# EAGLE design Steuerungsmodul (EAGLE 9.6.2)
BRD_SHEET_NAME: Schaltplan; PROJEKT_NAME: Verstärker_Innovativwoche; REVISION: 1.0; SCH_SHEET_NAME: Steuerungsmodul Verstärker; USER_NAME: Melcher-Millner/Scheffknecht

## Sheet 1 of 2: Input Switch
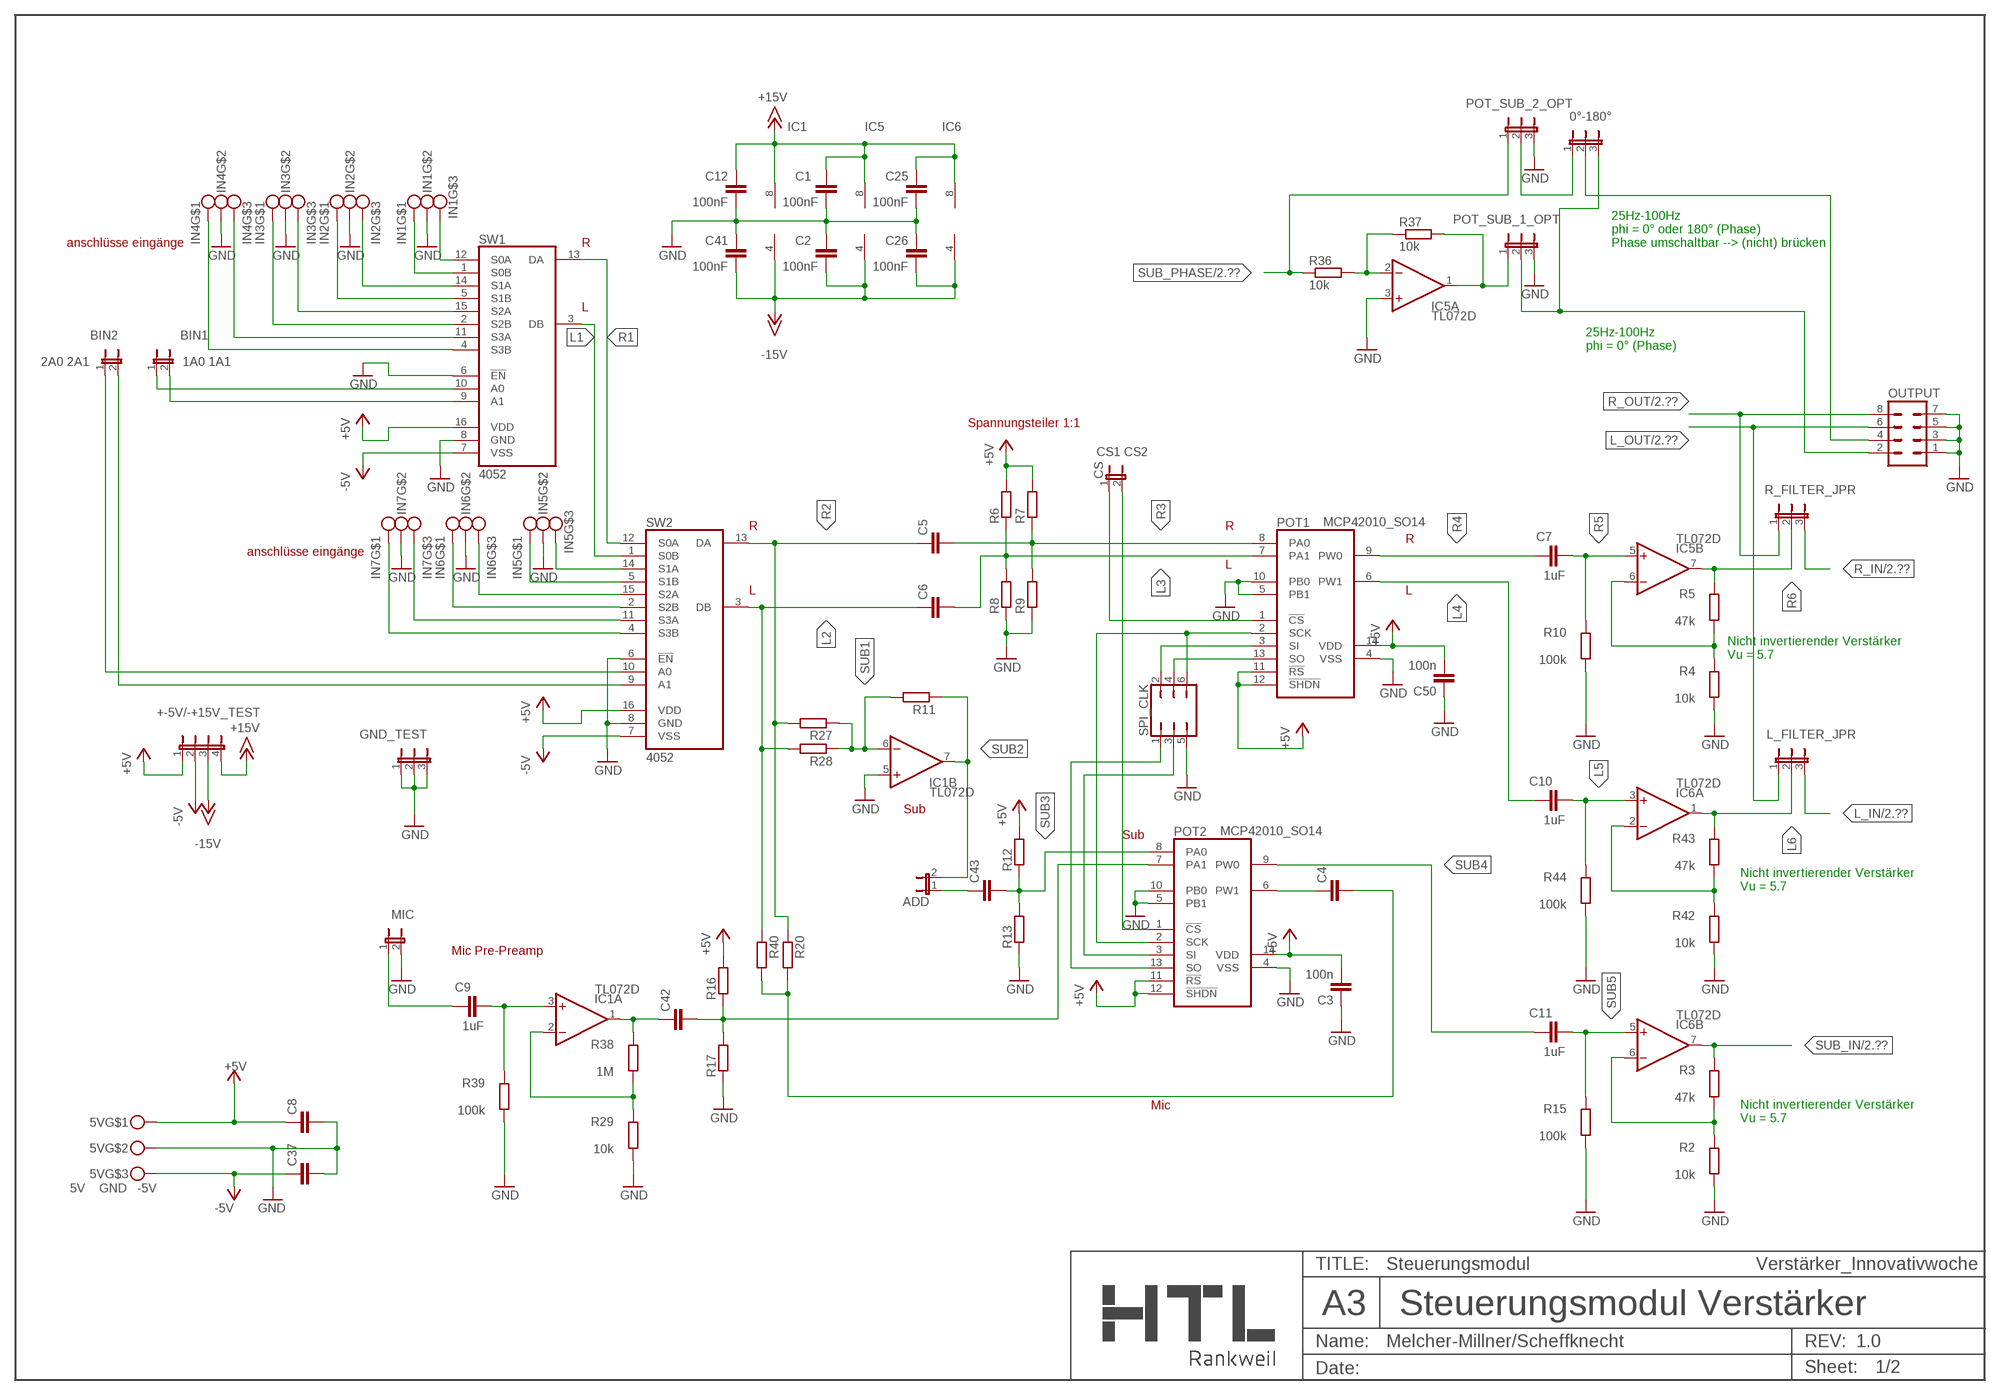
[diagram p0: schematic, sheet 1]

### Parts
0°-180°  JMP3  [JMP3]
5V  5V GND -5V  MKDS3/3_5,08  [MKDS3/3_5,08]
+-5V/-+15V_TEST  JP4E  [JP4]
ADD  JMP2  [JMP2]
BIN1  1A0 1A1  JMP2  [JMP2]
BIN2  2A0 2A1  JMP2  [JMP2]
C1  100nF  C-EUC0805  [C0805]
C2  100nF  C-EUC0805  [C0805]
C3  100n  C-EUC0805  [C0805]
C4  C-EUC0805  [C0805]
C5  C-EUC0805  [C0805]
C6  C-EUC0805  [C0805]
C7  1uF  C-EU025-025X050  [C025-025X050]
C8  C-EUC0805  [C0805]
C9  1uF  C-EU025-025X050  [C025-025X050]
C10  1uF  C-EU025-025X050  [C025-025X050]
C11  1uF  C-EU025-025X050  [C025-025X050]
C12  100nF  C-EUC0805  [C0805]
C25  100nF  C-EUC0805  [C0805]
C26  100nF  C-EUC0805  [C0805]
C37  C-EUC0805  [C0805]
C41  100nF  C-EUC0805  [C0805]
C42  C-EUC0805  [C0805]
C43  C-EUC0805  [C0805]
C50  100n  C-EUC0805  [C0805]
CS  CS1 CS2  JMP2  [JMP2]
FRAME1  HTL-A3-H  [HTL-LEER]
GND_TEST  JMP3  [JMP3]
IC1  TL072D  [SO08]
IC5  TL072D  [SO08]
IC6  TL072D  [SO08]
IN1  MKDS3/3_5,08  [MKDS3/3_5,08]
IN2  MKDS3/3_5,08  [MKDS3/3_5,08]
IN3  MKDS3/3_5,08  [MKDS3/3_5,08]
IN4  MKDS3/3_5,08  [MKDS3/3_5,08]
IN5  MKDS3/3_5,08  [MKDS3/3_5,08]
IN6  MKDS3/3_5,08  [MKDS3/3_5,08]
IN7  MKDS3/3_5,08  [MKDS3/3_5,08]
L_FILTER_JPR  JMP3  [JMP3]
MIC  JMP2  [JMP2]
OUTPUT  MA04-2  [MA04-2]
POT1  MCP42010_SO14  [SO14]
POT2  MCP42010_SO14  [SO14]
POT_SUB_1_OPT  JMP3  [JMP3]
POT_SUB_2_OPT  JMP3  [JMP3]
R2  10k  R-EU_M0805  [M0805]
R3  47k  R-EU_M0805  [M0805]
R4  10k  R-EU_M0805  [M0805]
R5  47k  R-EU_M0805  [M0805]
R6  R-EU_M0805  [M0805]
R7  R-EU_M0805  [M0805]
R8  R-EU_M0805  [M0805]
R9  R-EU_M0805  [M0805]
R10  100k  R-EU_M0805  [M0805]
R11  R-EU_M0805  [M0805]
R12  R-EU_M0805  [M0805]
R13  R-EU_M0805  [M0805]
R15  100k  R-EU_M0805  [M0805]
R16  R-EU_M0805  [M0805]
R17  R-EU_M0805  [M0805]
R20  R-EU_M0805  [M0805]
R27  R-EU_M0805  [M0805]
R28  R-EU_M0805  [M0805]
R29  10k  R-EU_M0805  [M0805]
R36  10k  R-EU_M0805  [M0805]
R37  10k  R-EU_M0805  [M0805]
R38  1M  R-EU_M0805  [M0805]
R39  100k  R-EU_M0805  [M0805]
R40  R-EU_M0805  [M0805]
R42  10k  R-EU_M0805  [M0805]
R43  47k  R-EU_M0805  [M0805]
R44  100k  R-EU_M0805  [M0805]
R_FILTER_JPR  JMP3  [JMP3]
SPI_CLK  JP3Q  [JP3Q]
SW1  4052  5042_SO16_NEU  [SO-16]
SW2  4052  5042_SO16_NEU  [SO-16]

### Nets
1A0: BIN1.1 SW1.10(A0)
1A1: BIN1.2 SW1.9(A1)
2A0: BIN2.1 SW2.10(A0)
2A1: BIN2.2 SW2.9(A1)
+5V: 5V.P$1 +-5V/-+15V_TEST.1 C3.2 C8.1 C50.2 POT1.11(!RS) POT1.12(!SHDN) POT1.14(VDD) POT2.11(!RS) POT2.12(!SHDN) POT2.14(VDD) R6.2 R7.2 R12.2 R16.2 SW1.16(VDD) SW2.16(VDD)
+15V: +-5V/-+15V_TEST.4 C1.1 C12.1 C25.1 IC1.8(P:V+) IC5.8(P:V+) IC6.8(P:V+) ; also sheet 2
-5V: 5V.P$3 +-5V/-+15V_TEST.2 C37.1 SW1.7(VSS) SW2.7(VSS)
-15V: +-5V/-+15V_TEST.3 C2.2 C26.2 C41.2 IC1.4(P:V-) IC5.4(P:V-) IC6.4(P:V-) ; also sheet 2
GND: 5V.P$2 C1.2 C2.1 C3.1 C8.2 C12.2 C25.2 C26.1 C37.2 C41.1 C50.1 GND_TEST.1 GND_TEST.2 GND_TEST.3 IC1.5(B:+IN) IC5.3(A:+IN) IN1.P$2 IN2.P$2 IN3.P$2 IN4.P$2 IN5.P$2 IN6.P$2 IN7.P$2 MIC.2 OUTPUT.1 OUTPUT.3 OUTPUT.5 OUTPUT.7 POT1.4(VSS) POT1.5(PB1) POT1.10(PB0) POT2.4(VSS) POT2.5(PB1) POT2.10(PB0) POT_SUB_1_OPT.3 POT_SUB_2_OPT.3 R2.1 R4.1 R8.1 R9.1 R10.1 R13.1 R15.1 R17.1 R29.1 R39.1 R42.1 R44.1 SPI_CLK.5 SW1.6(!EN) SW1.8(GND) SW2.6(!EN) SW2.8(GND) ; also sheet 2
L1: SW1.3(DB) SW2.1(S0B)
L2: C6.1 R28.2 R40.1 SW2.3(DB)
L3: C6.2 POT1.7(PA1) R6.1 R8.2
L4: C10.1 POT1.6(PW1)
L5: C10.2 IC6.3(A:+IN) R44.2
L6: IC6.1(A:OUT) L_FILTER_JPR.2 R43.2
L_IN: L_FILTER_JPR.3 ; also sheet 2
L_OUT: L_FILTER_JPR.1 OUTPUT.6 ; also sheet 2
N$1: CS.2 POT2.1(!CS)
N$2: CS.1 POT1.1(!CS)
N$3: IC5.1(A:OUT) POT_SUB_1_OPT.1 R37.2
N$10: POT1.3(SI) SPI_CLK.2
N$17: IC6.2(A:-IN) R42.2 R43.1
N$24: IC6.6(B:-IN) R2.2 R3.1
N$26: POT2.13(SO) SPI_CLK.1
N$28: IC5.6(B:-IN) R4.2 R5.1
N$30: C9.1 MIC.1
N$31: POT1.13(SO) SPI_CLK.4
N$32: POT2.3(SI) SPI_CLK.3
N$34: C4.1 POT2.6(PW1)
N$36: C42.2 POT2.7(PA1) R16.1 R17.2
N$37: POT1.2(SCK) POT2.2(SCK) SPI_CLK.6
N$38: IN1.P$3 SW1.12(S0A)
N$39: IN1.P$1 SW1.1(S0B)
N$40: IN2.P$3 SW1.14(S1A)
N$41: IN2.P$1 SW1.5(S1B)
N$42: IN3.P$3 SW1.15(S2A)
N$43: IN3.P$1 SW1.2(S2B)
N$44: IN4.P$3 SW1.11(S3A)
N$45: IN4.P$1 SW1.4(S3B)
N$46: IN5.P$3 SW2.14(S1A)
N$47: IN5.P$1 SW2.5(S1B)
N$48: IN6.P$3 SW2.15(S2A)
N$49: IN6.P$1 SW2.2(S2B)
N$50: IN7.P$3 SW2.11(S3A)
N$51: IN7.P$1 SW2.4(S3B)
N$53: C9.2 IC1.3(A:+IN) R39.2
N$62: IC1.2(A:-IN) R29.2 R38.1
N$64: ADD.1 C43.1
N$71: C42.1 IC1.1(A:OUT) R38.2
N$72: C4.2 R20.2 R40.2
N$80: IC5.2(A:-IN) R36.2 R37.1
N$81: 0°-180°.1 POT_SUB_2_OPT.2
R1: SW1.13(DA) SW2.12(S0A)
R2: C5.1 R20.1 R27.2 SW2.13(DA)
R3: C5.2 POT1.8(PA0) R7.1 R9.2
R4: C7.1 POT1.9(PW0)
R5: C7.2 IC5.5(B:+IN) R10.2
R6: IC5.7(B:OUT) R5.2 R_FILTER_JPR.2
R_IN: R_FILTER_JPR.3 ; also sheet 2
R_OUT: OUTPUT.8 R_FILTER_JPR.1 ; also sheet 2
SUB1: IC1.6(B:-IN) R11.2 R27.1 R28.1
SUB2: ADD.2 IC1.7(B:OUT) R11.1
SUB3: C43.2 POT2.8(PA0) R12.1 R13.2
SUB4: C11.1 POT2.9(PW0)
SUB5: C11.2 IC6.5(B:+IN) R15.2
SUB_IN: IC6.7(B:OUT) R3.2 ; also sheet 2
SUB_OUT_1: 0°-180°.3 OUTPUT.2 POT_SUB_1_OPT.2
SUB_OUT_2: 0°-180°.2 OUTPUT.4
SUB_PHASE: POT_SUB_2_OPT.1 R36.1 ; also sheet 2

### Notes on the sheet
- IC1 | IC5 | IC6
- anschlüsse eingänge | R
- 25Hz-100Hz
  phi = 0° oder 180° (Phase) 
  Phase umschaltbar --> (nicht) brücken
- L
- 25Hz-100Hz
  phi = 0° (Phase)
- Spannungsteiler 1:1
- R | R
- R
- anschlüsse eingänge
- L
- L | L
- Nicht invertierender Verstärker
  Vu = 5.7
- Sub
- Sub
- Nicht invertierender Verstärker
  Vu = 5.7
- Mic Pre-Preamp
- Mic
- Nicht invertierender Verstärker
  Vu = 5.7

## Sheet 2 of 2: Aktivfilter
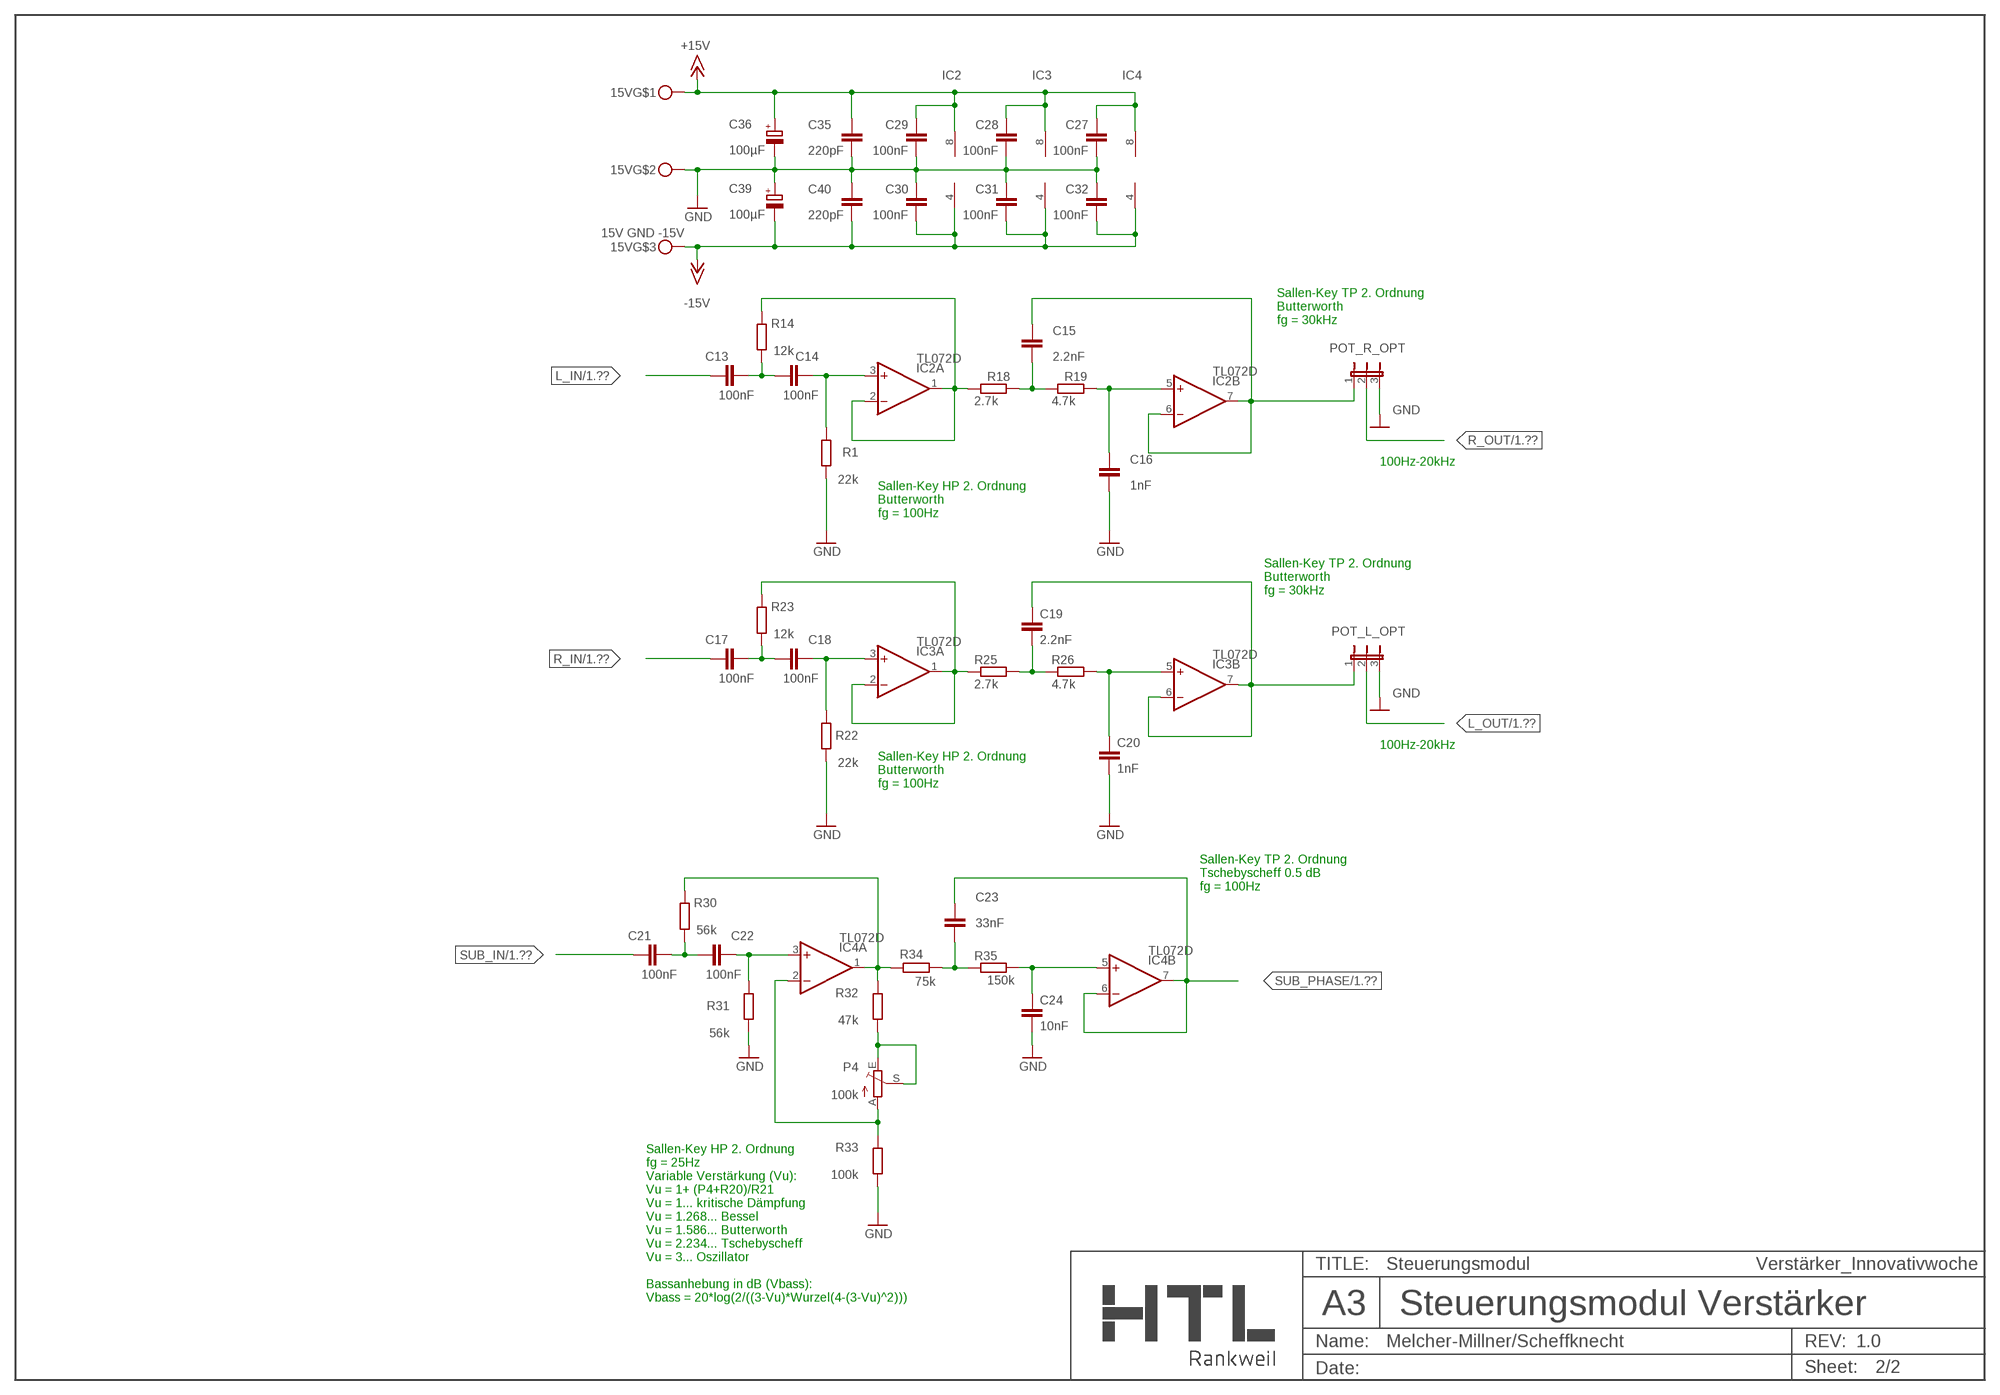
[diagram p1: schematic, sheet 2]

### Parts
15V  15V GND -15V  MKDS3/3_5,08  [MKDS3/3_5,08]
C13  100nF  C-EUC0805  [C0805]
C14  100nF  C-EUC0805  [C0805]
C15  2.2nF  C-EUC0805  [C0805]
C16  1nF  C-EUC0805  [C0805]
C17  100nF  C-EUC0805  [C0805]
C18  100nF  C-EUC0805  [C0805]
C19  2.2nF  C-EUC0805  [C0805]
C20  1nF  C-EUC0805  [C0805]
C21  100nF  C-EUC0805  [C0805]
C22  100nF  C-EUC0805  [C0805]
C23  33nF  C-EUC0805  [C0805]
C24  10nF  C-EUC0805  [C0805]
C27  100nF  C-EUC0805  [C0805]
C28  100nF  C-EUC0805  [C0805]
C29  100nF  C-EUC0805  [C0805]
C30  100nF  C-EUC0805  [C0805]
C31  100nF  C-EUC0805  [C0805]
C32  100nF  C-EUC0805  [C0805]
C35  220pF  C-EUC0805  [C0805]
C36  100µF  CPOL-EUE2.5-6  [E2,5-6]
C39  100µF  CPOL-EUE2.5-6  [E2,5-6]
C40  220pF  C-EUC0805  [C0805]
FRAME2  HTL-A3-H  [HTL-LEER]
IC2  TL072D  [SO08]
IC3  TL072D  [SO08]
IC4  TL072D  [SO08]
P4  100k  TRIM_EU-S64W  [S64W]
POT_L_OPT  JMP3  [JMP3]
POT_R_OPT  JMP3  [JMP3]
R1  22k  R-EU_M0805  [M0805]
R14  12k  R-EU_M0805  [M0805]
R18  2.7k  R-EU_M0805  [M0805]
R19  4.7k  R-EU_M0805  [M0805]
R22  22k  R-EU_M0805  [M0805]
R23  12k  R-EU_M0805  [M0805]
R25  2.7k  R-EU_M0805  [M0805]
R26  4.7k  R-EU_M0805  [M0805]
R30  56k  R-EU_M0805  [M0805]
R31  56k  R-EU_M0805  [M0805]
R32  47k  R-EU_M0805  [M0805]
R33  100k  R-EU_M0805  [M0805]
R34  75k  R-EU_M0805  [M0805]
R35  150k  R-EU_M0805  [M0805]

### Nets
+15V: 15V.P$1 C27.1 C28.1 C29.1 C35.1 C36.+ IC2.8(P:V+) IC3.8(P:V+) IC4.8(P:V+) ; also sheet 1
-15V: 15V.P$3 C30.2 C31.2 C32.2 C39.- C40.2 IC2.4(P:V-) IC3.4(P:V-) IC4.4(P:V-) ; also sheet 1
GND: 15V.P$2 C16.2 C20.2 C24.2 C27.2 C28.2 C29.2 C30.1 C31.1 C32.1 C35.2 C36.- C39.+ C40.1 POT_L_OPT.3 POT_R_OPT.3 R1.1 R22.1 R31.1 R33.1 ; also sheet 1
L_IN: C13.1 ; also sheet 1
L_OUT: POT_L_OPT.2 ; also sheet 1
N$56: IC2.1(A:OUT) IC2.2(A:-IN) R14.2 R18.1
N$57: C14.2 IC2.3(A:+IN) R1.2
N$58: C13.2 C14.1 R14.1
N$59: C15.2 R18.2 R19.1
N$60: C16.1 IC2.5(B:+IN) R19.2
N$61: C15.1 IC2.6(B:-IN) IC2.7(B:OUT) POT_R_OPT.1
N$65: IC3.1(A:OUT) IC3.2(A:-IN) R23.2 R25.1
N$66: C18.2 IC3.3(A:+IN) R22.2
N$67: C17.2 C18.1 R23.1
N$68: C19.2 R25.2 R26.1
N$69: C20.1 IC3.5(B:+IN) R26.2
N$70: C19.1 IC3.6(B:-IN) IC3.7(B:OUT) POT_L_OPT.1
N$73: C21.2 C22.1 R30.1
N$74: C22.2 IC4.3(A:+IN) R31.2
N$75: IC4.1(A:OUT) R30.2 R32.2 R34.2
N$76: IC4.2(A:-IN) P4.A R33.2
N$77: P4.E P4.S R32.1
N$78: C24.1 IC4.5(B:+IN) R35.2
N$79: C23.2 R34.1 R35.1
R_IN: C17.1 ; also sheet 1
R_OUT: POT_R_OPT.2 ; also sheet 1
SUB_IN: C21.1 ; also sheet 1
SUB_PHASE: C23.1 IC4.6(B:-IN) IC4.7(B:OUT) ; also sheet 1

### Notes on the sheet
- IC2 | IC3 | IC4
- Sallen-Key TP 2. Ordnung
  Butterworth
  fg = 30kHz
- 100Hz-20kHz
- Sallen-Key HP 2. Ordnung
  Butterworth
  fg = 100Hz
- Sallen-Key TP 2. Ordnung
  Butterworth
  fg = 30kHz
- 100Hz-20kHz
- Sallen-Key HP 2. Ordnung
  Butterworth
  fg = 100Hz
- Sallen-Key TP 2. Ordnung
  Tschebyscheff 0.5 dB
  fg = 100Hz
- Sallen-Key HP 2. Ordnung
  fg = 25Hz
  Variable Verstärkung (Vu): 
  Vu = 1+ (P4+R20)/R21
  Vu = 1... kritische Dämpfung
  Vu = 1.268... Bessel
  Vu = 1.586... Butterworth
  Vu = 2.234... Tschebyscheff
  Vu = 3... Oszillator
  
  Bassanhebung in dB (Vbass):
  Vbass = 20*log(2/((3-Vu)*Wurzel(4-(3-Vu)^2)))

## Library data of the parts
0°-180° GND_TEST L_FILTER_JPR POT_L_OPT POT_R_OPT POT_SUB_1_OPT POT_SUB_2_OPT R_FILTER_JPR = 0_HTL_elektro:JMP3: Jumper 3-polig
5V 15V IN1-IN7 = 0_HTL_elektro:MKDS3/3_5,08: Leiterplattenklemme 3-polig
+-5V/-+15V_TEST = jumper:JP4E: JUMPER
ADD BIN1 CS MIC = 0_HTL_elektro:JMP2: Jumper 2-polig
BIN2 = 0_HTL_elektro:JMP2: Jumper 2-polig; SPICEPREFIX: B
C1-C6 C8 C12-C32 C35 C37 C40-C43 C50 = rcl:C-EU: CAPACITOR, European symbol; SPICEPREFIX: C
C7 C9-C11 = resistor:C-EU: CAPACITOR, European symbol
C36 C39 = rcl:CPOL-EU: POLARIZED CAPACITOR, European symbol; SPICEPREFIX: C
FRAME1 FRAME2 = 0_HTL_frame:HTL-A3-H: Arbeitsblatt der HTL Rankweil für Schaltpläne DIN-A3 Landscape kombinierbar mit Boardplänen (CHANGE PACKAGE): DIN-A3 Landscape DIN-A3 Portrait DIN-A4 Landscape DIN-A4 Portrait Leer (für Projekte mit mehreren Schaltplänen und einem Board) Über Attribute werden die Beschriftungeinträge gesteuert: Attribut USER_NAME ( Schaltplan + Board) PROJEKT_NAME ( Schaltplan + Board) ACCOUNT_NAME ( Schaltplan + Board) REVISION ( Schaltplan + Board) SCH_SHEET_NAME ( Schaltplan) BRD_SHEET_NAME ( Board)
IC1-IC6 = linear:TL072: OP AMP
OUTPUT = con-lstb:MA04-2: PIN HEADER; OC_FARNELL: unknown; OC_NEWARK: unknown
P4 = pot:TRIM_EU-: POTENTIOMETER
POT1 POT2 = 0_Custom-Lib_Verstärker:MCP42010_SO14
R1-R20 R22 R23 R25-R40 R42-R44 = rcl:R-EU_: RESISTOR, European symbol; SPICEPREFIX: R
SPI_CLK = jumper:JP3Q: JUMPER
SW1 SW2 = 0_Custom-Lib_Verstärker:5042_SO16_NEU

## Board
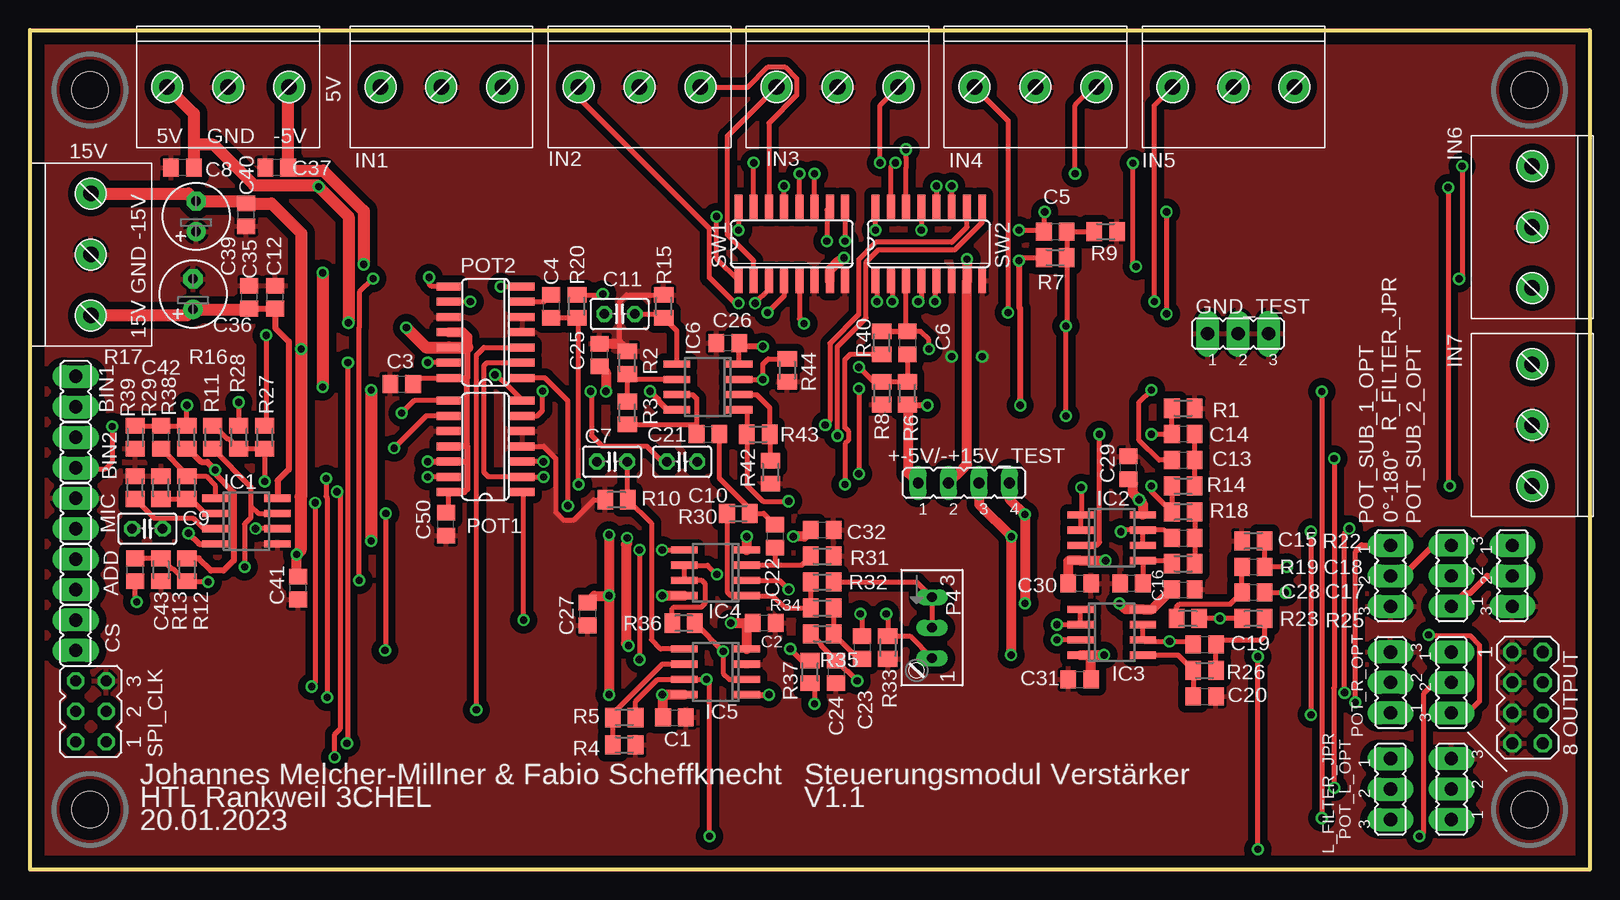
[diagram p2: board, top side]
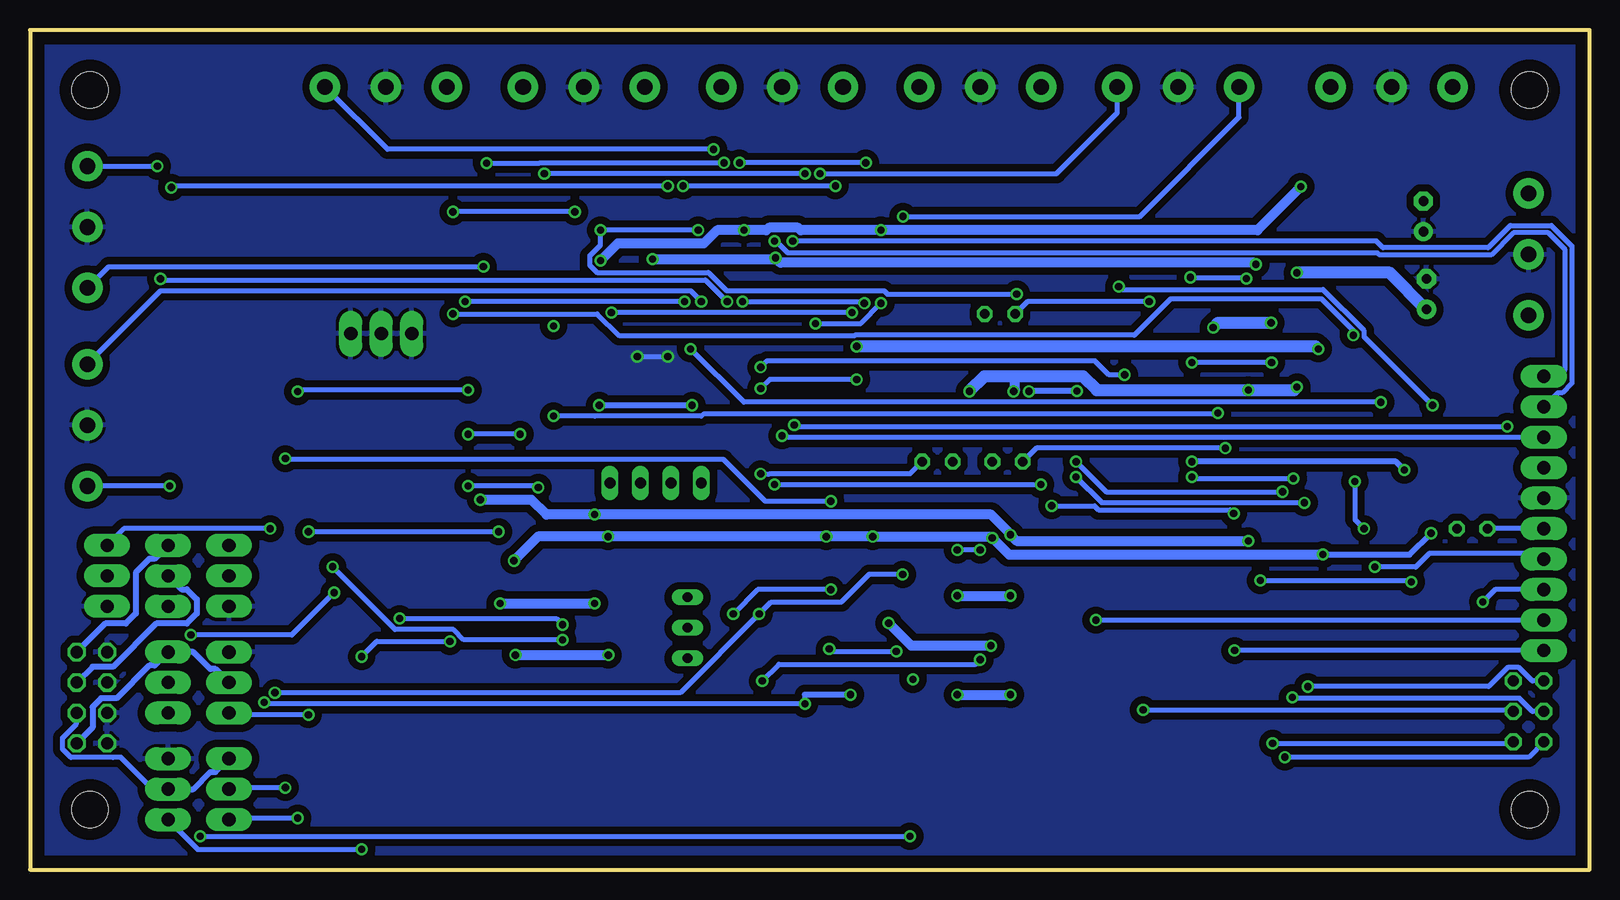
[diagram p3: board, bottom side, seen from below]

Size 130 x 70 mm. Coordinates in mm from the lower left corner, seen from the top.
Outline: 0,0 0,70 130,70 130,0 0,0
Copper layers (1*16): Top 0.035mm / dielectric 1.5mm / Bottom 0.035mm
Design rules "default": minimum track width 10mil, minimum drill 0.6mm, track to track 8mil, track to pad 8mil, pad to pad 8mil, via to via 8mil, smd to smd 8mil, copper to edge 40mil, drill to drill 8mil, minimum pad ring 10mil, minimum via ring 8mil, stop-mask expansion 4mil, vias tented up to drill 0mil, thermal gap 10mil
Holes 3 mm at 5,5 5,65 125,65 125,5

### Footprints (pad centres in the part's own frame; a part is rotated, then mirrored left to right if it is on the bottom)
JMP3 = drill 1.1 pad 1.93 long: 1 -2.54,0; 2 0,0; 3 2.54,0
MKDS3/3_5,08 = drill 1.3 pad 2.54: P$1 -5.08,0; P$2 0,0; P$3 5.08,0
JP4 = drill 0.914 long: 1 -3.81,0; 2 -1.27,0; 3 1.27,0; 4 3.81,0
JMP2 = drill 1.1 pad 1.93 long: 1 0,-1.27; 2 0,1.27
C0805 = smd 1.3 x 1.5: 1 -0.95,0; 2 0.95,0
C025-025X050 = drill 0.813 octagon: 1 -1.27,0; 2 1.27,0
E2,5-6 = drill 0.813 pad 1.6: + -1.27,0 | drill 0.813 pad 1.6 octagon: - 1.27,0
SO08 = smd 0.6 x 2.2: 1 -1.905,-2.6; 2 -0.635,-2.6; 3 0.635,-2.6; 4 1.905,-2.6; 5 1.905,2.6; 6 0.635,2.6; 7 -0.635,2.6; 8 -1.905,2.6
MA04-2 = drill 1.016 octagon: 1 -3.81,-1.27; 2 -3.81,1.27; 3 -1.27,-1.27; 4 -1.27,1.27; 5 1.27,-1.27; 6 1.27,1.27; 7 3.81,-1.27; 8 3.81,1.27
S64W = drill 0.813 long: A 2.54,1.27; E -2.54,1.27; S 0,1.27
SO14 = smd 0.66 x 2.032: 1 -3.81,-3.073; 2 -2.54,-3.073; 3 -1.27,-3.073; 4 0,-3.073; 5 1.27,-3.073; 6 2.54,-3.073; 7 3.81,-3.073; 8 3.81,3.073; 9 2.54,3.073; 10 1.27,3.073; 11 0,3.073; 12 -1.27,3.073; 13 -2.54,3.073; 14 -3.81,3.073
M0805 = smd 1.3 x 1.6: 1 -0.95,0; 2 0.95,0
JP3Q = drill 0.914 octagon: 1 -2.54,-1.27; 2 -2.54,1.27; 3 0,-1.27; 4 0,1.27; 5 2.54,-1.27; 6 2.54,1.27
SO-16 = smd 0.66 x 2.032: 1 -4.445,-3.073; 2 -3.175,-3.073; 3 -1.905,-3.073; 4 -0.635,-3.073; 5 0.635,-3.073; 6 1.905,-3.073; 7 3.175,-3.073; 8 4.445,-3.073; 9 4.445,3.073; 10 3.175,3.073; 11 1.905,3.073; 12 0.635,3.073; 13 -0.635,3.073; 14 -1.905,3.073; 15 -3.175,3.073; 16 -4.445,3.073

### Placement (x,y rotation side)
0°-180°  118.49,24.48 90 top
5V  16.51,65.25 0 top
15V  5.08,51.28 90 top
+-5V/-+15V_TEST  77.85,32.23 0 top
ADD  3.81,24.61 0 top
BIN1  3.81,39.85 0 top
BIN2  3.81,34.77 0 top
C1  53.72,12.67 0 top
C2  61.21,20.55 180 top
C3  30.99,40.48 0 top
C4  43.43,46.96 270 top
C5  85.47,53.19 0 top
C6  73.15,43.91 270 top
C7  48.51,34.01 0 top
C8  12.7,58.52 180 top
C9  9.78,28.42 0 top
C10  54.36,34.01 0 top
C11  49.15,46.33 0 top
C12  20.45,47.72 90 top
C13  96.14,34.14 0 top
C14  96.14,36.29 180 top
C15  96.14,27.66 0 top
C16  91.82,23.85 180 top
C17  101.98,23.09 180 top
C18  101.98,25.24 0 top
C19  97.92,18.77 0 top
C20  97.92,14.45 0 top
C21  56.52,36.29 0 top
C22  62.1,27.78 270 top
C23  69.34,18.51 270 top
C24  67.18,16.48 270 top
C25  47.5,42.9 90 top
C26  58.17,43.91 0 top
C27  46.48,21.31 270 top
C28  96.14,23.34 0 top
C29  91.57,33.5 90 top
C30  87.5,23.85 180 top
C31  87.5,15.85 0 top
C32  66.04,28.29 180 top
C35  18.29,47.72 90 top
C36  13.59,47.98 90 top
C37  20.57,58.52 180 top
C39  13.84,54.45 90 top
C40  18.03,54.58 90 top
C41  22.35,23.47 90 top
C42  10.92,36.04 90 top
C43  8.76,24.99 90 top
C50  34.67,28.78 90 top
CS  3.81,19.53 180 top
FRAME1  -0.25,-0.28 0 top
FRAME2  -1.27,-30 0 top  (outside the outline)
GND_TEST  100.71,44.68 0 top
IC1  18.03,29.05 270 top
IC2  90.17,27.66 270 top
IC3  90.17,19.78 270 top
IC4  57.15,24.74 90 top
IC5  57.15,16.48 90 top
IC6  56.52,40.23 90 top
IN1  34.29,65.25 0 top
IN2  50.8,65.25 0 top
IN3  67.31,65.25 0 top
IN4  83.82,65.25 0 top
IN5  100.33,65.25 0 top
IN6  125.22,53.57 270 top
IN7  125.22,37.06 270 top
L_FILTER_JPR  113.41,6.7 270 top
MIC  3.81,29.69 0 top
OUTPUT  124.84,14.32 270 top
P4  73.91,20.16 270 top
POT1  37.97,35.28 90 top
POT2  37.97,44.8 90 top
POT_L_OPT  118.49,6.7 90 top
POT_R_OPT  113.41,15.59 90 top
POT_SUB_1_OPT  113.41,24.48 270 top
POT_SUB_2_OPT  123.57,24.48 270 top
R1  96.14,38.45 180 top
R2  49.78,42.26 270 top
R3  49.78,38.07 270 top
R4  49.53,10.39 180 top
R5  49.53,12.67 0 top
R6  73.15,39.72 270 top
R7  85.47,51.03 180 top
R8  70.99,39.72 90 top
R9  89.66,53.19 180 top
R10  48.9,30.83 0 top
R11  15.24,36.04 90 top
R12  13.08,24.99 90 top
R13  10.92,24.99 90 top
R14  96.14,31.98 180 top
R15  52.83,46.96 270 top
R16  13.08,36.04 270 top
R17  8.76,36.04 90 top
R18  96.14,29.82 0 top
R19  96.14,25.5 180 top
R20  45.59,46.96 270 top
R22  101.98,27.4 0 top
R23  96.52,20.93 0 top
R25  101.98,20.93 0 top
R26  97.92,16.61 180 top
R27  19.56,36.04 90 top
R28  17.4,36.04 90 top
R29  10.92,31.85 270 top
R30  59.05,29.69 180 top
R31  66.04,26.13 180 top
R32  66.04,23.98 180 top
R33  71.5,18.51 90 top
R34  66.04,21.82 180 top
R35  66.04,19.66 180 top
R36  54.48,20.55 0 top
R37  65.02,16.48 270 top
R38  13.08,31.85 90 top
R39  8.76,31.85 270 top
R40  70.99,43.91 270 top
R42  61.72,33.12 90 top
R43  60.71,36.29 180 top
R44  63.12,41.63 90 top
R_FILTER_JPR  118.49,15.59 270 top
SPI_CLK  5.08,13.18 90 top
SW1  63.5,52.17 0 top
SW2  74.93,52.17 0 top
U$1  [HTL-A4-H]  -57.66,-46.26 0 top  (outside the outline)

### Tracks (layer width: path | path; a pad name or v marks a point on that pad's centre or on a via)
1A0  (via drill 0.6)
  Top 0.406: SW1.10 66.42,54.99 v66.42,52.4
  Bottom 0.406: BIN1.1 2.64,39.75 2.28,39.75 1.47,40.55 1.47,51.99 3.17,53.69 6.6,53.69 8.45,51.85 17.21,51.85 17.76,52.4 v66.42,52.4
1A1  (via drill 0.6)
  Top 0.406: SW1.9 v67.94,52.4
  Bottom 0.406: v67.94,52.4 67.82,52.4 66.82,51.4 17.66,51.4 17.5,51.24 8.19,51.24 6.35,53.08 3.43,53.08 2.08,51.74 2.08,41.63 2.59,41.12 BIN1.2
2A0  (via drill 0.6)
  Top 0.406: v6.86,36.95 6.86,34.01 6.22,33.37 3.94,33.37 BIN2.1 | SW2.10 78.11,53.57 76.83,52.3 70.48,52.3 69.06,50.87 69.06,46.26 66.67,43.87 66.67,37.44 v66.29,37.06
  Bottom 0.406: v66.29,37.06 66.19,36.95 v6.86,36.95
2A1  (via drill 0.6)
  Top 0.406: SW2.9 79.38,53.97 77.09,51.69 70.74,51.69 69.7,50.65 69.7,45.99 67.31,43.6 v67.31,36.17
  Bottom 0.406: v67.31,36.17 67.18,36.04 BIN2.2
+5V  (via drill 0.6)
  Top 0.406: SW1.16 v59.05,53.31 | v70.48,53.31 SW2.16 | v82.44,50.77 82.7,51.03 R7.2 | C3.2 32.45,40.99 POT2.14 | C50.2 34.9,29.96 POT1.14
  Top 0.508: v82.44,50.77 82.44,46.88 82.55,46.78 v82.55,38.71 | v74.8,38.71 73.22,38.71 R6.2 | 36.45,43.53 36.45,40.99 | POT2.14 36.45,40.99 | 36.45,35.28 36.45,40.99 | 36.45,35.28 POT1.11 | 36.45,35.28 36.45,34.01 | 36.45,34.01 POT1.12 v33.15,34.01 | 36.45,34.01 36.45,31.72 36.2,31.47 POT1.14 | R16.2 13.14,35.09 14.25,33.98 14.77,33.98 v15.44,33.32 15.44,33 16.99,31.45 16.99,25.77 16.15,24.92 15.1,24.92 14.07,25.94 R12.2
  Top 0.813: POT2.11 36.07,44.8 36.45,44.42 36.45,43.53 | +-5V/-+15V_TEST.1 73.22,33.05 73.22,38.71
  Top 1.016: v26.54,45.59 26.54,54.45 v24.07,56.93 23.94,57.06 18.68,57.06 15.31,60.42 13.78,60.42 13.65,60.3 | 13.65,60.3 13.65,63.03 5V.P$1 | 13.65,60.3 C8.1 | v31.37,45.18 33.02,43.53 POT2.12 36.45,43.53
  Bottom 0.508: v74.8,38.71 v82.55,38.71 | v15.44,33.32 16.13,34.01 v33.15,34.01
  Bottom 0.813: v24.07,56.93 27.69,53.31 v59.05,53.31 65.76,53.31 65.96,53.52 68.41,53.52 68.61,53.31 v70.48,53.31 72.72,53.31 73.83,52.2 81.02,52.2 v82.44,50.77
  Bottom 1.016: v26.54,45.59 30.97,45.59 v31.37,45.18
+15V  (via drill 0.6)
  Top 0.406: IC6.8 53.14,38.33
  Top 0.508: C35.1 C12.1 20.45,45.14 21.57,44.03 21.57,33.35 20.63,32.42 IC1.8 | v51.68,39.88 52.36,39.2 52.36,39.11 53.14,38.33
  Top 0.813: IC5.8 v52.7,14.58 52.77,14.51 C1.1 | v48.26,27.91 v48.26,22.83 | v48.26,22.83 v48.26,14.58 | IC4.8 v52.7,22.83 | IC2.8 92.77,30.52 v92.46,30.83 91.95,31.34 91.95,32.17 C29.1 | v90.81,22.2 91.31,21.69 IC3.8 93.54,21.69 C28.1 | v82.93,22.2 v82.93,29.59 81.66,30.86 +-5V/-+15V_TEST.4 | C27.1 47.06,22.83 v48.26,22.83 | C25.1 48.01,41.44 v48.01,39.87
  Top 1.016: 15V.P$1 13.08,46.2 C36.+ 18.22,46.71 C35.1 | v24.38,49.76 v24.38,40.23 | v28.45,39.98 v28.45,27.4
  Bottom 0.813: v52.7,14.58 v48.26,14.58 | v28.45,27.4 47.75,27.4 v48.26,27.91 48.26,27.96 49.89,29.59 v82.93,29.59 86.95,29.59 88.19,30.83 v92.46,30.83 | v52.7,22.83 v48.26,22.83 | v90.81,22.2 v82.93,22.2 | v48.01,39.87 47.88,40 47.88,41.12
  Bottom 1.016: C36.+ 16.64,49.76 v24.38,49.76 | v24.38,40.23 24.64,39.98 v28.45,39.98 41.08,39.98 42.22,41.12 47.88,41.12 50.44,41.12 v51.68,39.88
-5V  (via drill 0.6)
  Top 0.813: +-5V/-+15V_TEST.2 77.8,33.45 77.8,33.49 78.11,33.79 SW2.7 v78.11,50.9 | SW1.7 66.67,50.03 67.36,50.72 67.57,50.72 v67.84,51
  Top 1.016: 5V.P$3 21.52,65.18 C37.1 21.77,58.28 24.45,58.28 27.81,54.91 v27.81,50.46
  Bottom 0.813: v78.11,50.9 67.94,50.9 v67.84,51 67.43,50.59 27.94,50.59 v27.81,50.46
-15V  (via drill 0.6)
  Top 0.406: IC6.4 C26.2
  Top 0.508: v61.09,43.62 59.41,43.62 C26.2 | v13.21,28.04 14.1,27.15 IC1.4
  Top 0.813: IC4.4 v59.75,27.76 | v49.78,27.66 49.78,27.2 49.69,27.1 49.69,18.87 v49.89,18.66 | v58.42,20.55 59.69,20.55 | 59.69,20.55 C2.2 | IC5.4 59.75,20.49 59.69,20.55 | IC3.4 88.39,17.88 | 88.39,17.88 v89.53,17.88 | v81.79,17.88 81.79,27.73 v81.82,27.76 79.12,30.45 +-5V/-+15V_TEST.3 | C30.2 86.55,25.69 86.61,25.75 IC2.4 v89.66,25.75 | C32.2 64.56,27.76 v63.63,27.76 | C41.2 22.23,24.54 v22.23,26.26 | C31.2 88.45,17.82 88.39,17.88
  Top 1.016: 15V.P$3 13.21,56.36 C39.- 17.84,55.72 C40.2 20.13,55.53 22.61,53.06 v22.61,43.41 22.61,31.13 22.55,31.08 22.55,26.59 v22.23,26.26
  Bottom 0.508: v22.23,26.26 14.99,26.26 v13.21,28.04
  Bottom 0.813: v22.23,26.26 48.39,26.26 v49.78,27.66 49.88,27.76 v59.75,27.76 v63.63,27.76 v81.82,27.76 87.66,27.76 v89.66,25.75 | v49.89,18.66 56.54,18.66 v58.42,20.55 | v89.53,17.88 v81.79,17.88
  Bottom 1.016: v22.61,43.41 22.62,43.41 22.84,43.62 v61.09,43.62
GND  (via drill 0.6)
  Top 0.406: 49.15,43.85 49.15,47.34 49.72,47.91 R15.1 | POT1.4 42.81,35.28 43.81,34.28 43.81,29.8 44.45,29.16 45.34,29.16 47.01,30.83 R10.1
  Top 0.813: C25.2 49.15,43.85 R2.1
  Bottom 0.406: v79.38,42.77 v76.83,42.77
  pour Top (isolate 0.61): 0,0 130,0 130,70 0,70
  pour Bottom (isolate 0.61): 0,0 0,70 130,70 130,0
L1  (via drill 0.6)
  Top 0.406: SW2.1 70.61,48.97 v70.61,47.34 | SW1.3 61.59,48.36 v60.45,47.22
  Bottom 0.406: v70.61,47.34 60.58,47.34 v60.45,47.22
L2  (via drill 0.6)
  Top 0.406: v17.4,38.96 R28.2 | v74.93,43.41 74.93,44.17 74.23,44.86 R40.1 C6.1 73.03,44.99 SW2.3
  Bottom 0.406: v74.93,43.41 70.48,38.96 v17.4,38.96
L3  (via drill 0.6)
  Top 0.406: C6.2 R6.1 R8.2 70.3,40.67 v69.09,41.88 | POT1.7 39.88,40.26 39.86,40.26 38.87,41.25 v38.76,41.25
  Bottom 0.406: v38.76,41.25 40.04,41.25 41.21,42.42 68.56,42.42 v69.09,41.88
L4  (via drill 0.6)
  Top 0.406: POT1.6 42.29,37.82 42.73,38.25 v42.73,39.91 | v46.74,39.87 46.8,39.81 46.8,36.18 47.67,35.3 51.41,35.3 52.7,34.01 C10.1
  Bottom 0.508: v42.73,39.91 46.7,39.91 v46.74,39.87
L5  (via drill 0.6)
  Top 0.406: IC6.3 v61.09,40.87 61.09,42.14 61.53,42.58 R44.2 | v69.09,40.1 v69.09,32.99
  Bottom 0.406: v61.09,40.87 68.33,40.87 v69.09,40.1 | v69.09,32.99 68.34,32.99 68.32,33.01 56.62,33.01 C10.2
L6  (via drill 0.6)
  Top 0.406: IC6.1 59.75,38.33 59.76,38.32 R43.2 59.76,32.04 61.09,30.71 v63.25,30.71 | v108.71,34.26 108.71,15.16 108.67,15.12 108.67,6.87 v108.71,6.83
  Bottom 0.406: v63.25,30.71 68.71,30.71 72.2,34.2 108.65,34.2 v108.71,34.26 | v108.71,6.83 113.28,6.83 L_FILTER_JPR.2
L_IN  (via drill 0.6)
  Top 0.406: C13.1 94.11,34.14 92.46,35.79 92.46,38.96 v93.47,39.98 | v107.7,39.85 v107.7,4.29
  Bottom 0.406: v93.47,39.98 107.57,39.98 v107.7,39.85 | v107.7,4.29 113.28,4.29 L_FILTER_JPR.3
L_OUT
  Bottom 0.406: POT_L_OPT.2 119.76,6.7 122.43,9.37 123.06,9.37 123.09,9.34 126.59,9.34 127.28,10.03 127.28,11 126.11,12.16 OUTPUT.6
  Bottom 0.508: L_FILTER_JPR.1 114.53,8.12 114.97,8.12 116.39,6.7 POT_L_OPT.2
N$1  (via drill 0.6)
  Top 0.406: POT2.1 42.93,40.99 44.83,39.09 v44.83,30.33 | v29.66,29.68 29.66,18.33 v29.59,18.26
  Bottom 0.406: CS.2 v29.59,18.26 | v44.83,30.33 41.26,30.33 40.92,29.98 29.96,29.98 v29.66,29.68
N$2  (via drill 0.6)
  Top 0.406: v41.15,20.8 41.15,31.37 POT1.1
  Bottom 0.406: v41.15,20.8 CS.1
N$3  (via drill 0.6)
  Top 0.406: R37.2 65.41,15.15 v65.41,13.81 | v110.49,13.94 110.49,26.52 110.62,26.64
  Top 0.508: IC5.1 v61.59,14.58 | 110.62,26.64 111,27.02 POT_SUB_1_OPT.1
  Bottom 0.406: 65.41,14.58 v65.41,13.81 110.36,13.81 v110.49,13.94
  Bottom 0.508: v61.59,14.58 65.41,14.58
N$10  (via drill 0.6)
  Top 0.406: v42.8,34.01 POT1.3 | v25.4,9.37 25.4,11.27 25.84,11.71 25.84,31.24 v25.59,31.5
  Bottom 0.406: v42.8,34.01 40.29,31.5 v25.59,31.5 | SPI_CLK.2 5.08,9.37 v25.4,9.37
N$17
  Top 0.406: IC6.2 60.58,39.6 61.66,38.52 R43.1 61.72,36.23 R42.2
N$24
  Top 0.406: IC6.6 50.23,40.87 R2.2 R3.1
N$26  (via drill 0.6)
  Top 0.406: POT2.13 v33.15,42.26 | v26.5,42.26 26.5,10.59 v26.42,10.51
  Bottom 0.406: v26.42,10.51 6.48,10.51 SPI_CLK.1 | v26.5,42.26 v33.15,42.26
N$28
  Top 0.406: IC5.6 52.7,17.12 48.58,12.99 R5.1 R4.2
N$30
  Bottom 0.406: MIC.1 C9.1
N$31  (via drill 0.6)
  Top 0.406: POT1.13 v33.15,32.74 | v24.77,14.34 24.77,31.04 24.68,31.12 v24.68,32.61
  Bottom 0.406: v33.15,32.74 33.02,32.61 v24.68,32.61 | SPI_CLK.4 4.77,13.18 5.89,14.3 24.72,14.3 v24.77,14.34
N$32  (via drill 0.6)
  Top 0.406: v37.21,13.31 37.21,42.9 37.85,43.53 POT2.3
  Bottom 0.406: v37.21,13.31 6.48,13.31 SPI_CLK.3
N$34
  Top 0.406: C4.1 42.87,47.34 POT2.6
N$36  (via drill 0.6)
  Top 0.406: R17.2 C42.2 R16.1 v13.08,38.71 | v39.24,48.61 POT2.7
  Bottom 0.406: v13.08,38.71 18.77,44.4 18.77,44.93 22.21,48.36 38.99,48.36 v39.24,48.61
N$37  (via drill 0.6)
  Top 0.406: POT2.2 38.1,42.26 37.85,42.01 37.85,33.12 38.23,32.74 POT1.2 42.8,32.74 v42.81,32.73 | v23.77,30.58 23.77,15.55 v23.47,15.25
  Bottom 0.406: v42.81,32.73 40.67,30.59 v23.78,30.59 v23.77,30.58 | v23.47,15.25 8.4,15.25 6.81,16.84 5.89,16.84 4.77,15.72 SPI_CLK.6
N$38  (via drill 0.6)
  Top 0.406: SW1.12 v64.14,58.01
  Bottom 0.406: v64.14,58.01 44.45,58.01 39.37,63.09 IN1.P$3
N$39  (via drill 0.6)
  Top 0.406: SW1.1 57.24,50.92 v57.24,54.45
  Bottom 0.406: v57.24,54.45 37.47,54.45 29.21,62.71 IN1.P$1
N$40
  Top 0.406: SW1.14 61.59,62.24 63.91,64.56 63.91,65.94 62.92,66.93 61.54,66.93 59.86,65.25 IN2.P$3
N$41  (via drill 0.6)
  Top 0.406: IN2.P$1 45.72,64.36 56.63,53.45 56.63,49.35 58.76,47.22 v59.05,47.22 | SW1.5 64.14,45.91 v64.52,45.52
  Bottom 0.406: v64.52,45.52 60.75,45.52 v59.05,47.22
N$42  (via drill 0.6)
  Top 0.406: SW1.15 v60.33,58.92 | v70.87,58.92 70.87,63.73 IN3.P$3
  Bottom 0.406: v60.33,58.92 v70.87,58.92
N$43
  Top 0.406: SW1.2 60.33,50.76 58.15,52.94 58.15,61.15 62.23,65.23 IN3.P$1
N$44  (via drill 0.6)
  Top 0.406: SW1.11 v65.41,58.01 | v87.12,58.01 87.12,63.73 88.65,65.25 IN4.P$3
  Bottom 0.406: v65.41,58.01 v87.12,58.01
N$45  (via drill 0.6)
  Top 0.406: IN4.P$1 81.53,62.46 v81.53,46.43 | SW1.4 62.87,47.83 v61.47,46.43
  Bottom 0.406: v61.47,46.43 v81.53,46.43
N$46  (via drill 0.6)
  Top 0.406: SW2.14 73.03,58.52 73.05,58.54 73.05,59.3 73.03,59.32 v73.03,60.04
  Bottom 0.406: v73.03,60.04 100.2,60.04 IN5.P$3
N$47  (via drill 0.6)
  Top 0.406: SW2.5 75.44,48.97 v75.44,47.34 | v93.73,47.34 93.73,63.73 IN5.P$1
  Bottom 0.406: v75.44,47.34 v93.73,47.34
N$48  (via drill 0.6)
  Top 0.406: SW2.15 71.75,58.52 71.78,58.54 71.78,58.56 v72.14,58.92 | v92.2,50.26 91.95,50.52 v91.95,58.9
  Bottom 0.406: IN6.P$3 123.44,50.26 v92.2,50.26 | v91.95,58.9 87.52,58.9 87.5,58.92 v72.14,58.92
N$49  (via drill 0.6)
  Top 0.406: SW2.2 71.88,48.97 v71.88,47.34 | v119.38,58.65 119.38,49.5 v119.13,49.25
  Bottom 0.406: v71.88,47.34 73.7,49.16 119.04,49.16 v119.13,49.25 | IN6.P$1 v119.38,58.65
N$50  (via drill 0.6)
  Top 0.406: SW2.11 v76.83,57 | v118.22,56.87 118.22,32.12 v118.36,31.98
  Bottom 0.406: v76.83,57 118.09,57 v118.22,56.87 | v118.36,31.98 IN7.P$3
N$51  (via drill 0.6)
  Top 0.406: SW2.4 74.3,47.6 v74.04,47.34
  Bottom 0.406: v74.04,47.34 74.04,47.36 74.93,48.25 119.11,48.25 IN7.P$1
N$53
  Top 0.406: IC1.3 14.48,28.42 13.59,29.31 11.05,29.31 | R39.2 10.35,29.31 11.05,29.31 | C9.2 11.05,29.31
N$56  (via drill 0.6)
  Top 0.406: v87.63,31.85 87.63,29.62 IC2.1 IC2.2 | v93.47,31.98 93.47,31.53 R18.1 R14.2
  Bottom 0.406: v93.47,31.98 87.76,31.98 v87.63,31.85
N$57  (via drill 0.6)
  Top 0.406: IC2.3 88.9,27.02 89.15,27.28 v89.15,36.29 | v93.47,36.29 C14.2 R1.2
  Bottom 0.406: v89.15,36.29 v93.47,36.29
N$58
  Top 0.406: R14.1 C13.2 C14.1
N$59
  Top 0.406: R18.2 C15.2 R19.1
N$60
  Top 0.406: R19.2 94.94,25.75 IC2.5 C16.1
N$61  (via drill 0.6)
  Top 0.406: IC2.6 IC2.7 | C15.1 94.55,28.29 IC2.7 | IC2.7 91.06,28.29 v90.93,28.17 | v106.79,28.17 v106.79,12.91
  Bottom 0.406: v90.93,28.17 v106.79,28.17 | v106.79,12.91 113.26,12.91 POT_R_OPT.1
N$62
  Top 0.406: IC1.2 14.61,29.69 13.4,30.9 R38.1 R29.2
N$64  (via drill 0.6)
  Top 0.406: v8.89,22.32 8.76,22.45 C43.1
  Bottom 0.406: ADD.1 7.87,23.34 v8.89,22.32
N$65  (via drill 0.6)
  Top 0.406: IC3.1 IC3.2 v85.6,20.42 | R25.1 v99.19,20.93 R23.2
  Bottom 0.406: v99.19,20.93 86.11,20.93 v85.6,20.42
N$66  (via drill 0.6)
  Top 0.406: R22.2 C18.2 v104.78,25.24 | IC3.3 v85.6,19.15
  Bottom 0.406: v104.78,25.24 100.1,20.57 100.1,20.55 99.56,20.02 94.7,20.02 93.84,19.15 v85.6,19.15
N$67
  Top 0.406: C18.1 C17.2 100.08,22.13 95.82,22.13 95.57,21.88 R23.1
N$68
  Top 0.406: R26.1 C19.2 99.25,19.15 102.62,19.15 102.93,19.46 R25.2
N$69
  Top 0.406: IC3.5 95.7,17.88 R26.2 C20.1
N$70  (via drill 0.6)
  Top 0.406: IC3.7 IC3.6 92.9,19.02 v95,19.02 96.71,19.02 C19.1 | v102.36,1.68 v102.36,17.75
  Bottom 0.406: POT_L_OPT.1 116.73,2.41 116.73,2.39 116.03,1.68 v102.36,1.68 | v102.36,17.75 101.09,19.02 v95,19.02
N$71
  Top 0.406: C42.1 13.08,32.93 R38.2 14.67,32.8 15.43,32.04 IC1.1
N$72  (via drill 0.6)
  Top 0.406: C4.2 R20.2 45.74,45.86 v45.74,32.1 | v67.94,32.1 67.94,35.52 68.22,35.79 68.22,36.54 67.92,36.84 67.92,42.51 68.38,42.96 R40.2
  Bottom 0.406: v67.94,32.1 v45.74,32.1
N$73
  Top 0.406: C21.2 57.47,32.61 60.01,30.07 R30.1 61.15,29.69 C22.1
N$74
  Top 0.406: R31.2 64.33,25.37 62.1,25.37 | 62.1,25.37 IC4.3 | C22.2 62.1,25.37
N$75
  Top 0.406: R32.2 R34.2 62.93,21.82 61.91,22.83 IC4.1 58.42,22.83 58.17,23.09 58.17,29.63 R30.2
N$76  (via drill 0.6)
  Top 0.406: IC4.2 62.48,24.1 v63.25,23.34 | v71.37,21.31 71.5,21.18 R33.2 73.34,19.46 P4.A
  Bottom 0.406: v63.25,23.34 69.34,23.34 v71.37,21.31
N$77
  Top 0.406: R32.1 73.91,23.98 P4.E P4.S
N$78  (via drill 0.6)
  Top 0.406: v52.7,26.64 IC4.5 | v50.8,26.64 v50.8,17.5 | R35.2 65.93,18.81 65.93,18.69 C24.1 68.03,16.59 68.1,16.59 68.34,16.35 68.34,16.34 v68.96,15.72
  Bottom 0.406: v68.96,15.72 67.56,17.12 51.18,17.12 v50.8,17.5 | v50.8,26.64 v52.7,26.64
N$79
  Top 0.406: R34.1 R35.1 69.08,17.56 C23.2
N$80  (via drill 0.6)
  Top 0.406: R36.2 v57.78,18.19 57.78,16.35 58.29,15.85 IC5.2 | R37.1 64.33,17.43 v63.37,18.39
  Bottom 0.406: v63.37,18.39 63.18,18.19 v57.78,18.19
N$81
  Top 0.508: 0°-180°.1 119.61,23.06 120.05,23.06 121.47,24.48 POT_SUB_2_OPT.2
R1  (via drill 0.6)
  Top 0.406: SW1.13 v62.87,57 | v75.56,57 SW2.12
  Bottom 0.406: v62.87,57 v75.56,57
R2  (via drill 0.6)
  Top 0.406: SW2.13 v74.3,53.31 | v82.44,53.31 84.39,53.31 C5.1 84.58,53.25 v84.58,54.84 | v94.74,54.84 v94.74,46.33 | v19.68,44.55 19.68,37.12 R27.2 | R20.1 47.69,47.91 v47.75,47.98
  Bottom 0.406: v74.3,53.31 v82.44,53.31 82.44,52.06 83.35,51.15 83.35,50.39 82.73,49.77 73.45,49.77 71.93,48.25 58.8,48.25 58.53,47.98 v47.75,47.98 | v84.58,54.84 v94.74,54.84 | v94.74,46.33 82.71,46.33 80.92,44.53 61.23,44.53 61.21,44.55 37.96,44.55 34.91,47.6 22.35,47.6 19.68,44.93 v19.68,44.55
R3  (via drill 0.6)
  Top 0.406: R9.2 C5.2 R7.1 86.42,45.37 v86.36,45.31 v86.36,37.82 | POT1.8 32.02,39.09 v30.99,38.05
  Bottom 0.406: v30.99,38.05 31.33,38.05 31.41,37.97 73.87,37.97 74.05,37.8 82.93,37.8 82.95,37.82 v86.36,37.82
R4  (via drill 0.6)
  Top 0.406: POT1.9 33.04,37.82 v30.35,35.13
  Bottom 0.406: C7.1 46.12,35.13 v30.35,35.13
R5
  Top 0.406: C7.2 49.78,30.89 R10.2 51.8,28.88 51.8,19.17 52.58,18.39 IC5.5
R6  (via drill 0.6)
  Top 0.406: R5.2 50.48,14 52.32,15.85 IC5.7 v56.39,15.85 56.64,15.59 v56.64,2.77 | R_FILTER_JPR.2 117.11,15.59 116.15,14.64 116.15,3.1 v115.82,2.77
  Bottom 0.406: v115.82,2.77 v56.64,2.77
R_IN  (via drill 0.6)
  Top 0.406: C17.1 v104.65,23.09 | v116.59,19.56 116.64,19.51 120.02,19.51 120.83,18.7 120.83,14.01 119.87,13.05 R_FILTER_JPR.3
  Bottom 0.406: v104.65,23.09 108.17,19.56 v116.59,19.56
R_OUT
  Bottom 0.508: POT_R_OPT.2 114.53,16.71 114.97,16.71 116.39,18.13 R_FILTER_JPR.1 119.61,17.02 120.05,17.02 122.79,14.27 124.08,14.27 124.79,13.56 124.79,11.83 OUTPUT.8
SUB1  (via drill 0.6)
  Top 0.406: IC1.6 v18.8,28.42 | R11.2 15.37,36.99 16.43,35.93 16.55,35.93 R28.1 R27.1 v19.56,32.36
  Bottom 0.406: v19.56,32.36 19.56,29.18 v18.8,28.42
SUB2  (via drill 0.6)
  Top 0.406: R11.1 18.41,31.91 18.41,30.33 | 18.41,30.33 19.05,29.69 IC1.7 | 18.41,30.33 18.41,29.33 17.89,28.8 v17.89,25.22
  Bottom 0.406: v17.89,25.22 14.48,25.22 13.32,26.39 4.32,26.39 ADD.2
SUB3  (via drill 0.6)
  Top 0.406: v14.86,23.98 14.79,24.04 R12.1 12.95,24.04 11.89,25.1 11.77,25.1 R13.2 C43.2 | POT2.8 33.49,48.61 33.27,48.83 v33.27,49.38 | v27.43,24.1 27.43,24.61 27.41,24.63 27.41,45.16 27.46,45.21 27.46,48.13 v28.59,49.27
  Bottom 0.406: v27.43,24.1 14.99,24.1 v14.86,23.98 | v33.27,49.38 28.7,49.38 v28.59,49.27
SUB4  (via drill 0.6)
  Top 0.406: POT2.9 v36.7,47.34
  Bottom 0.406: v36.7,47.34 46.86,47.34 C11.1
SUB5
  Top 0.406: C11.2 52.52,46.33 R15.2 53.91,44.93 IC6.5
SUB_IN
  Top 0.406: IC6.7 55.24,39.6 55.56,39.28 55.56,37.06 | 55.56,37.06 C21.1 | R3.2 55.5,37.12 55.56,37.06
SUB_OUT_1
  Top 0.508: POT_SUB_1_OPT.2 114.43,24.48 116.97,27.02 0°-180°.3
  Bottom 0.508: 0°-180°.3 119.61,25.91 120.05,25.91 121.18,24.77 121.18,21.35 122.02,20.52 123.72,20.52 OUTPUT.2
SUB_OUT_2
  Bottom 0.508: 0°-180°.2 117.37,23.37 116.94,23.37 116.1,22.53 116.1,21.35 116.94,20.52 119.46,20.52 123.07,16.91 124.79,16.91 OUTPUT.4
SUB_PHASE  (via drill 0.6)
  Top 0.406: v57.26,24.61 56.49,25.37 IC4.6 IC4.7 56.01,24.1 56.31,23.8 56.31,22.24 55.97,21.89 53.67,21.89 53.53,21.76 R36.1 | C23.1 69.34,21.18 v69.22,21.31 | v109.58,14.74 109.58,28.02 v109.98,28.42
  Bottom 0.406: v57.26,24.61 60.05,24.61 62.36,22.3 68.22,22.3 v69.22,21.31 75.78,14.74 v109.58,14.74 | v109.98,28.42 122.17,28.42 POT_SUB_2_OPT.1

### Text on the board
tNames: Johannes Melcher-Millner & Fabio Scheffknecht | Steuerungsmodul Verstärker | HTL Rankweil 3CHEL | V1.1 | 20.01.2023